# Altium project 单片机课设.PrjPcb
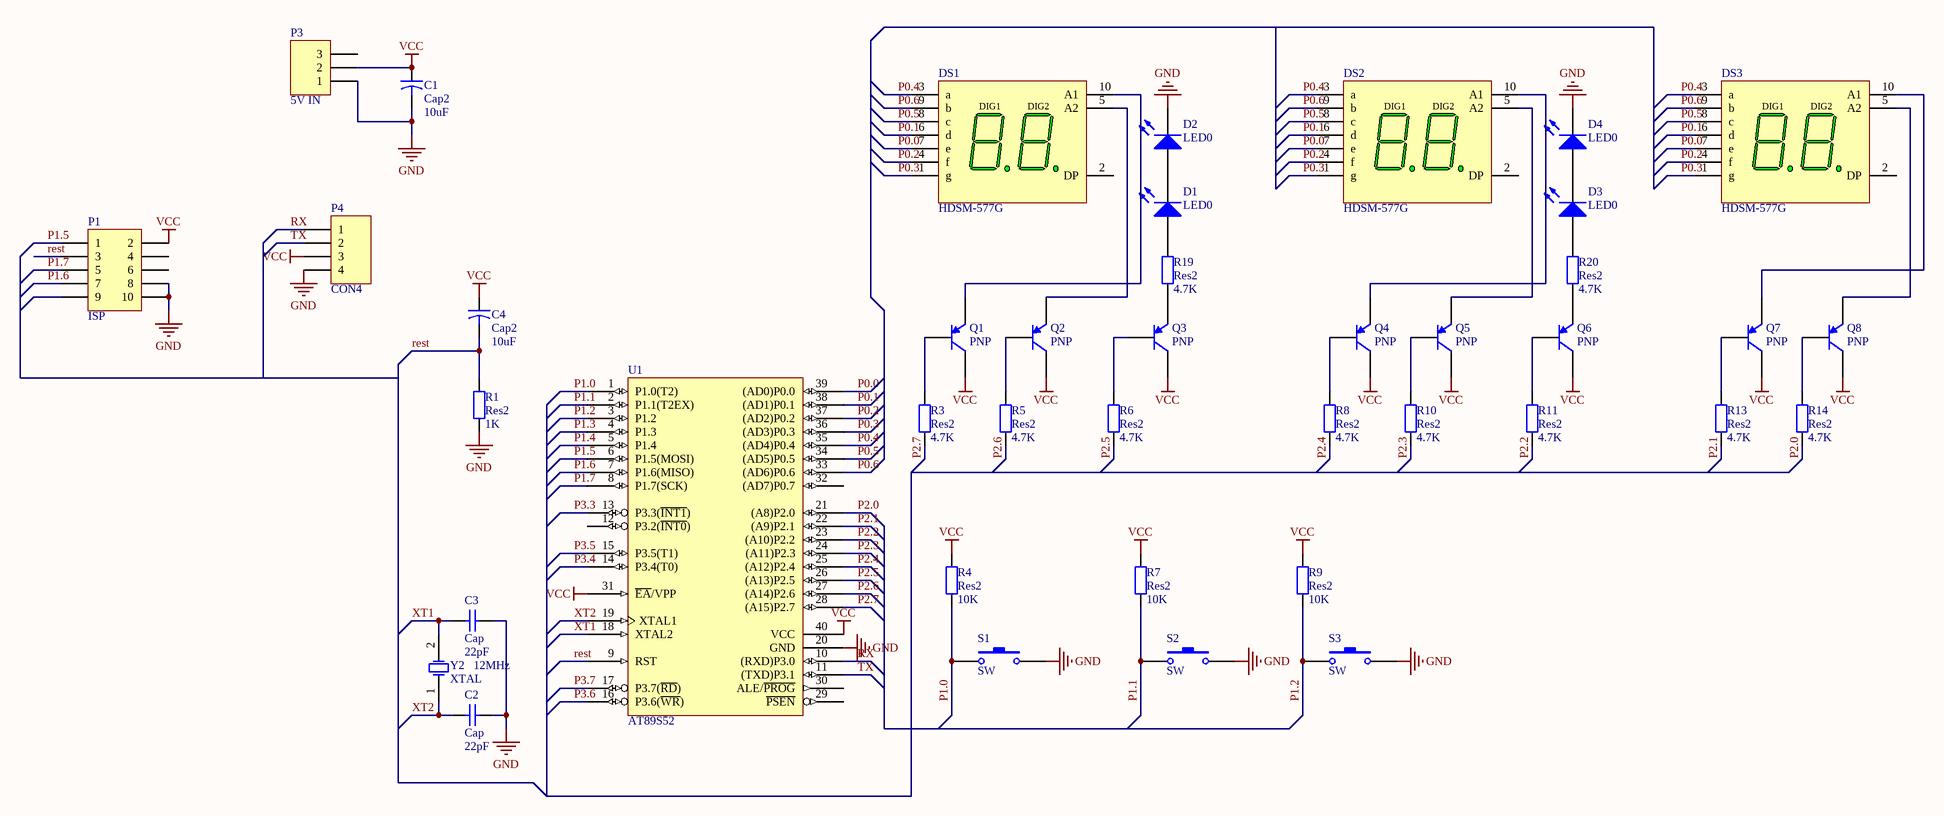
[diagram p0: 数字时钟.SchDoc]
1 sheet, 41 parts. Net scope: global (net labels, ports and power ports of the same name join across sheets).
Board file: 数字时钟.PcbDoc

## Sheet 数字时钟.SchDoc
size A3

### Parts
C1  Cap2  value 10uF  [CAPR5-4X5]
C2  Cap  value 22pF  [CAPR5-4X5]
C3  Cap  value 22pF  [CAPR5-4X5]
C4  Cap2  value 10uF  [CAPR5-4X5]
D1  LED0  [LED-0]
D2  LED0  [LED-0]
D3  LED0  [LED-0]
D4  LED0  [LED-0]
DS1  HDSM-577G  [HDSM-577]
DS2  HDSM-577G  [HDSM-577]
DS3  HDSM-577G  [HDSM-577]
P1  ISP  [HDR2X5]
P3  5V IN  [HDR1X3]
P4  CON4  [HDR1X4]
Q1  PNP  [E3]
Q2  PNP  [E3]
Q3  PNP  [E3]
Q4  PNP  [E3]
Q5  PNP  [E3]
Q6  PNP  [E3]
Q7  PNP  [E3]
Q8  PNP  [E3]
R1  Res2  value 1K  [AXIAL-0.4]
R3  Res2  value 4.7K  [AXIAL-0.4]
R4  Res2  value 10K  [AXIAL-0.4]
R5  Res2  value 4.7K  [AXIAL-0.4]
R6  Res2  value 4.7K  [AXIAL-0.4]
R7  Res2  value 10K  [AXIAL-0.4]
R8  Res2  value 4.7K  [AXIAL-0.4]
R9  Res2  value 10K  [AXIAL-0.4]
R10  Res2  value 4.7K  [AXIAL-0.4]
R11  Res2  value 4.7K  [AXIAL-0.4]
R13  Res2  value 4.7K  [AXIAL-0.4]
R14  Res2  value 4.7K  [AXIAL-0.4]
R19  Res2  value 4.7K  [AXIAL-0.4]
R20  Res2  value 4.7K  [AXIAL-0.4]
S1  SW  [SW4/6]
S2  SW  [SW4/6]
S3  SW  [SW4/6]
U1  AT89S52  [DIP-40]
Y2_12MHz  XTAL  [XTAL1]

### Nets
GND: C1.2 C2.2 C3.2 D2.2(K) D4.2(K) P1.8 P1.10 P3.1 P4.4 R1.1 S1.2 S2.2 S3.2 U1.20(GND)
VCC: C1.1 C4.1 P1.2 P3.2 P4.3 Q1.1(C) Q2.1(C) Q3.1(C) Q4.1(C) Q5.1(C) Q6.1(C) Q7.1(C) Q8.1(C) R4.2 R7.2 R9.2 U1.31(~{EA}/VPP) U1.40(VCC)
P0.0: DS1.7(e) DS2.7(e) DS3.7(e) U1.39((AD0)P0.0)
P0.1: DS1.6(d) DS2.6(d) DS3.6(d) U1.38((AD1)P0.1)
P0.2: DS1.4(f) DS2.4(f) DS3.4(f) U1.37((AD2)P0.2)
P0.3: DS1.1(g) DS2.1(g) DS3.1(g) U1.36((AD3)P0.3)
P0.4: DS1.3(a) DS2.3(a) DS3.3(a) U1.35((AD4)P0.4)
P0.5: DS1.8(c) DS2.8(c) DS3.8(c) U1.34((AD5)P0.5)
P0.6: DS1.9(b) DS2.9(b) DS3.9(b) U1.33((AD6)P0.6)
P1.0: R4.1 S1.1 U1.1(P1.0(T2))
P1.1: R7.1 S2.1 U1.2(P1.1(T2EX))
P1.2: R9.1 S3.1 U1.3(P1.2)
P1.3: U1.4(P1.3)
P1.4: U1.5(P1.4)
P1.5: P1.1 U1.6(P1.5(MOSI))
P1.6: P1.7 U1.7(P1.6(MISO))
P1.7: P1.5 U1.8(P1.7(SCK))
P2.0: R14.1 U1.21((A8)P2.0)
P2.1: R13.1 U1.22((A9)P2.1)
P2.2: R11.1 U1.23((A10)P2.2)
P2.3: R10.1 U1.24((A11)P2.3)
P2.4: R8.1 U1.25((A12)P2.4)
P2.5: R6.1 U1.26((A13)P2.5)
P2.6: R5.1 U1.27((A14)P2.6)
P2.7: R3.1 U1.28((A15)P2.7)
P3.3: U1.13(P3.3(~{INT1}))
P3.4: U1.14(P3.4(T0))
P3.5: U1.15(P3.5(T1))
P3.6: U1.16(P3.6(~{WR}))
P3.7: U1.17(P3.7(~{RD}))
rest: C4.2 P1.3 R1.2 U1.9(RST)
RX: P4.1 U1.10((RXD)P3.0)
TX: P4.2 U1.11((TXD)P3.1)
XT1: C3.1 U1.18(XTAL2) Y2_12MHz.2(OSC2)
XT2: C2.1 U1.19(XTAL1) Y2_12MHz.1(OSC1)
NetD1_1: D1.1(A) R19.2
NetD1_2: D1.2(K) D2.1(A)
NetD3_1: D3.1(A) R20.2
NetD3_2: D3.2(K) D4.1(A)
NetDS1_5: DS1.5(A2) Q2.3(E)
NetDS1_10: DS1.10(A1) Q1.3(E)
NetDS2_5: DS2.5(A2) Q5.3(E)
NetDS2_10: DS2.10(A1) Q4.3(E)
NetDS3_5: DS3.5(A2) Q8.3(E)
NetDS3_10: DS3.10(A1) Q7.3(E)
NetQ1_2: Q1.2(B) R3.2
NetQ2_2: Q2.2(B) R5.2
NetQ3_2: Q3.2(B) R6.2
NetQ3_3: Q3.3(E) R19.1
NetQ4_2: Q4.2(B) R8.2
NetQ5_2: Q5.2(B) R10.2
NetQ6_2: Q6.2(B) R11.2
NetQ6_3: Q6.3(E) R20.1
NetQ7_2: Q7.2(B) R13.2
NetQ8_2: Q8.2(B) R14.2

Not connected (* = marked no-connect by the designer): DS1 2(DP); DS2 2(DP); DS3 2(DP); P1 4 6 9; P3 3; U1 12(P3.2(~{INT0})) 29(~{PSEN}) 30(ALE/~{PROG}) 32((AD7)P0.7)

### Notes on the sheet
- (in symbol HDSM-577G) DIG1; DIG2

### Library data of the parts
C1 C4 = Cap2: Capacitor; Published: 23-Sep-2002; PackageReference: CAPR5-4X5; Publisher: Altium Limited
C2 C3 = Cap: Capacitor; Published: 8-Jun-2000; LatestRevisionDate: 17-Jul-2002; LatestRevisionNote: Re-released for DXP Platform.; PackageReference: RAD-0.3; Publisher: Altium Limited
D1-D4 = LED0: Typical INFRARED GaAs LED; Published: 8-Jun-2000; LatestRevisionDate: 08-Jul-2005; LatestRevisionNote: Mech Layer 1 removed.; PackageReference: LED-0; Publisher: Altium Limited
DS1-DS3 = HDSM-577G: 9.2 mm Green 7-Segment Display: 2-Digit, RH DP; LuminousIntensity: 1100 ucd (Minimum).; Published: 26-May-2004; LatestRevisionDate: 11-Oct-2004; LatestRevisionNote: Display outline superimposed on PCB Footprint.; DatasheetDocument: 14-Mar-2003; PackageDocument: 14-Mar-2003; PackageReference: HDSM-577; Publisher: Altium Limited; LED_Colour: Green; ComponentLink1Description: Manufacturer Link; ComponentLink1URL: http://www.agilent.com/
P1 = Header 5X2: Header, 5-Pin, Dual row; LatestRevisionDate: 17-Jul-2002; LatestRevisionNote: Re-released for DXP Platform.; Publisher: Altium Limited
P3 = Header 3: Header, 3-Pin; LatestRevisionDate: 17-Jul-2002; LatestRevisionNote: Re-released for DXP Platform.; Publisher: Altium Limited
P4 = Header 4: Header, 4-Pin; LatestRevisionDate: 17-Jul-2002; LatestRevisionNote: Re-released for DXP Platform.; Publisher: Altium Limited
Q1-Q8 = PNP: PNP Bipolar Transistor; Published: 8-Jun-2000; LatestRevisionDate: 17-Jul-2002; LatestRevisionNote: Re-released for DXP Platform.; PackageReference: SOT-23B; Publisher: Altium Limited; Code_JEDEC: SOT-23
R1 R3-R11 R13 R14 R19 R20 = Res2: Resistor; Published: 8-Jun-2000; LatestRevisionDate: 17-Jul-2002; LatestRevisionNote: Re-released for DXP Platform.; PackageReference: AXIAL-0.4; Publisher: Altium Limited
S1-S3 = SW-4Pin: 2X2Pin
U1 = AT89S52: 8-Bit Microcontroller with 8K ISP Flash ROM
Y2_12MHz = XTAL: Crystal Oscillator; Published: 8-Jun-2000; LatestRevisionDate: 17-Jul-2002; LatestRevisionNote: Re-released for DXP Platform.; PackageReference: R38; Publisher: Altium Limited